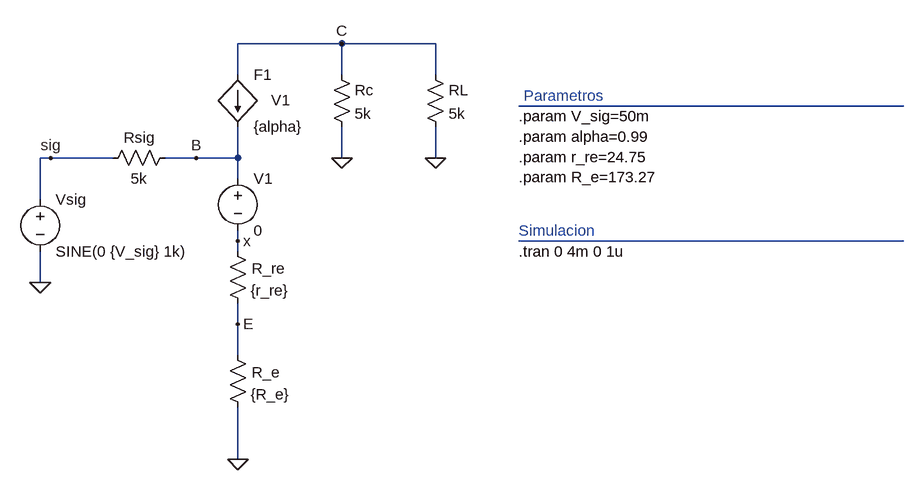
[diagram p0: schematic EC_resistencia_ejemplo2_parte2.asc]
EC_resistencia_ejemplo2_parte2.asc, the LTspice schematic file:
Version 4
SHEET 1 1220 680
WIRE -16 -208 -176 -208
WIRE 128 -208 -16 -208
WIRE -176 -160 -176 -208
WIRE -16 -160 -16 -208
WIRE 128 -160 128 -208
WIRE 848 -112 256 -112
WIRE -464 -32 -480 -32
WIRE -368 -32 -464 -32
WIRE -240 -32 -288 -32
WIRE -176 -32 -176 -80
WIRE -176 -32 -240 -32
WIRE -16 -32 -16 -80
WIRE 128 -32 128 -80
WIRE -176 0 -176 -32
WIRE -480 32 -480 -32
WIRE -176 96 -176 80
WIRE 848 96 256 96
WIRE -176 112 -176 96
WIRE -480 160 -480 112
WIRE -176 224 -176 192
WIRE -176 272 -176 224
WIRE -176 432 -176 352
FLAG -480 160 0
FLAG -176 432 0
FLAG -16 -32 0
FLAG -464 -32 sig
FLAG -240 -32 B
FLAG -176 224 E
FLAG -16 -208 C
FLAG -176 96 x
FLAG 128 -32 0
SYMBOL voltage -480 16 R0
WINDOW 123 0 0 Left 0
WINDOW 39 0 0 Left 0
SYMATTR InstName Vsig
SYMATTR Value SINE(0 {V_sig} 1k)
SYMBOL res -192 96 R0
WINDOW 0 37 42 Left 2
SYMATTR InstName R_re
SYMATTR Value {r_re}
SYMBOL res -32 -176 R0
SYMATTR InstName Rc
SYMATTR Value 5k
SYMBOL res -384 -16 R270
WINDOW 0 32 56 VTop 2
WINDOW 3 0 56 VBottom 2
SYMATTR InstName Rsig
SYMATTR Value 5k
SYMBOL res -192 256 R0
WINDOW 0 37 42 Left 2
SYMATTR InstName R_e
SYMATTR Value {R_e}
SYMBOL f -176 -160 R0
WINDOW 38 51 39 Left 2
SYMATTR InstName F1
SYMATTR Value {alpha}
SYMATTR SpiceModel V1
SYMBOL voltage -176 -16 R0
SYMATTR InstName V1
SYMATTR Value 0
SYMBOL res 112 -176 R0
SYMATTR InstName RL
SYMATTR Value 5k
TEXT 256 -96 Left 2 !.param V_sig=50m\n.param alpha=0.99\n.param r_re=24.75\n.param R_e=173.27
TEXT 256 112 Left 2 !.tran 0 4m 0 1u
TEXT 264 -128 Left 2 ;Parametros
TEXT 256 80 Left 2 ;Simulacion

The netlist it stands for:
* EC_resistencia_ejemplo2_parte2.asc
Vsig sig 0 SINE(0 {V_sig} 1k)
R_re x E {r_re}
Rc C 0 5k
Rsig sig B 5k
R_e E 0 {R_e}
F1 C B V1 {alpha}
V1 B x 0
RL C 0 5k
.param V_sig=50m
.param alpha=0.99
.param r_re=24.75
.param R_e=173.27
.tran 0 4m 0 1u
* Parametros
* Simulacion
.backanno
.end